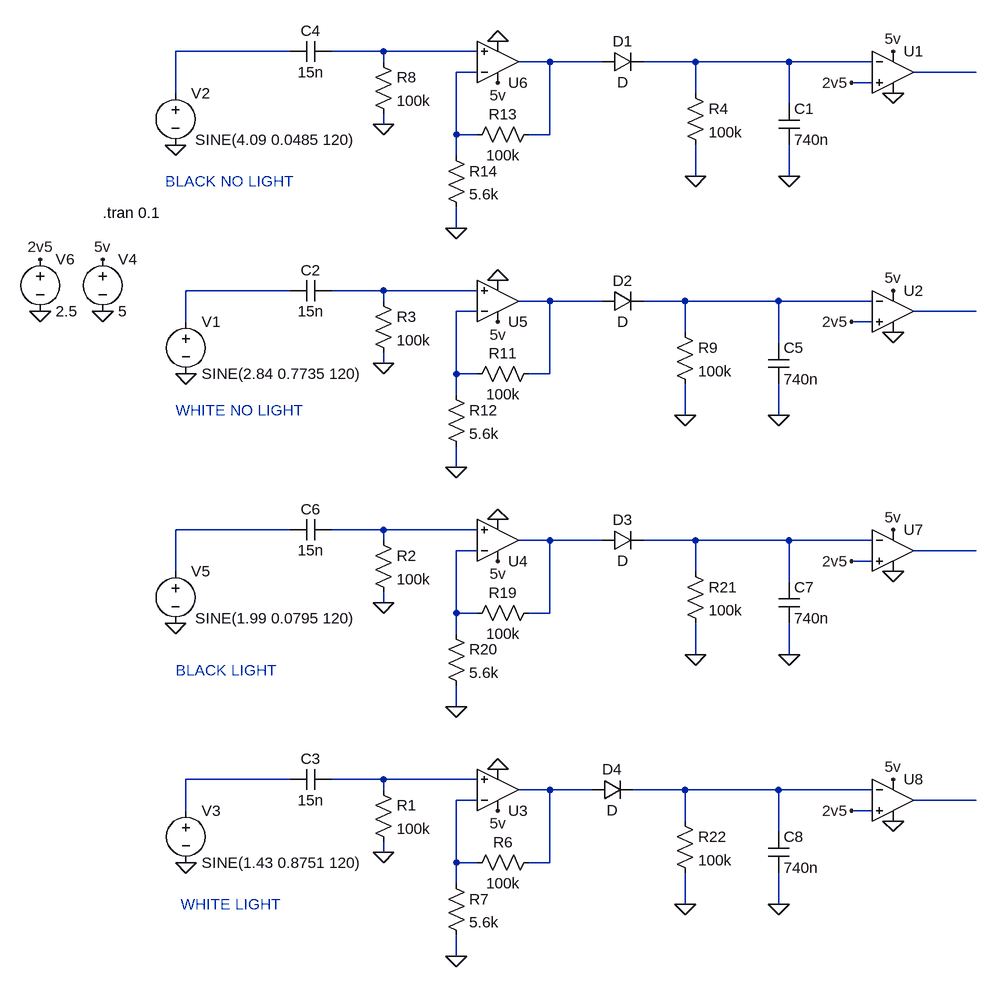
[diagram p0: schematic draft1.asc]
draft1.asc, the LTspice schematic file:
Version 4
SHEET 1 1572 1268
WIRE -64 -464 -240 -464
WIRE 80 -464 0 -464
WIRE 224 -464 80 -464
WIRE 80 -448 80 -464
WIRE 336 -448 288 -448
WIRE 416 -448 336 -448
WIRE 560 -448 480 -448
WIRE 704 -448 560 -448
WIRE 832 -448 704 -448
WIRE 224 -432 192 -432
WIRE 992 -432 896 -432
WIRE 832 -416 800 -416
WIRE -240 -400 -240 -464
WIRE 560 -400 560 -448
WIRE 704 -384 704 -448
WIRE 80 -352 80 -368
WIRE 192 -336 192 -432
WIRE 224 -336 192 -336
WIRE 336 -336 336 -448
WIRE 336 -336 304 -336
WIRE 192 -304 192 -336
WIRE 560 -272 560 -320
WIRE 704 -272 704 -320
WIRE 192 -192 192 -224
WIRE -64 -96 -224 -96
WIRE 80 -96 0 -96
WIRE 224 -96 80 -96
WIRE 80 -80 80 -96
WIRE 336 -80 288 -80
WIRE 416 -80 336 -80
WIRE 544 -80 480 -80
WIRE 688 -80 544 -80
WIRE 832 -80 688 -80
WIRE 224 -64 192 -64
WIRE 992 -64 896 -64
WIRE -224 -48 -224 -96
WIRE 832 -48 800 -48
WIRE 544 -32 544 -80
WIRE 688 -16 688 -80
WIRE 80 16 80 0
WIRE 192 32 192 -64
WIRE 224 32 192 32
WIRE 336 32 336 -80
WIRE 336 32 304 32
WIRE 192 64 192 32
WIRE 544 96 544 48
WIRE 688 96 688 48
WIRE 192 176 192 144
WIRE -64 272 -240 272
WIRE 80 272 0 272
WIRE 224 272 80 272
WIRE 80 288 80 272
WIRE 336 288 288 288
WIRE 416 288 336 288
WIRE 560 288 480 288
WIRE 704 288 560 288
WIRE 832 288 704 288
WIRE 224 304 192 304
WIRE 992 304 896 304
WIRE 832 320 800 320
WIRE -240 336 -240 272
WIRE 560 336 560 288
WIRE 704 352 704 288
WIRE 80 384 80 368
WIRE 192 400 192 304
WIRE 224 400 192 400
WIRE 336 400 336 288
WIRE 336 400 304 400
WIRE 192 432 192 400
WIRE 560 464 560 416
WIRE 704 464 704 416
WIRE 192 544 192 512
WIRE -64 656 -224 656
WIRE 80 656 0 656
WIRE 224 656 80 656
WIRE 80 672 80 656
WIRE 336 672 288 672
WIRE 400 672 336 672
WIRE 544 672 464 672
WIRE 688 672 544 672
WIRE 832 672 688 672
WIRE 224 688 192 688
WIRE 992 688 896 688
WIRE -224 704 -224 656
WIRE 832 704 800 704
WIRE 544 720 544 672
WIRE 688 736 688 672
WIRE 80 768 80 752
WIRE 192 784 192 688
WIRE 224 784 192 784
WIRE 336 784 336 672
WIRE 336 784 304 784
WIRE 192 816 192 784
WIRE 544 848 544 800
WIRE 688 848 688 800
WIRE 192 928 192 896
FLAG -224 32 0
FLAG -352 -64 0
FLAG -352 -144 5v
FLAG 80 16 0
FLAG -240 -320 0
FLAG 80 -352 0
FLAG 256 -48 5v
FLAG 256 -112 0
FLAG 192 176 0
FLAG 256 -416 5v
FLAG 256 -480 0
FLAG 192 -192 0
FLAG 560 -272 0
FLAG 704 -272 0
FLAG 544 96 0
FLAG 688 96 0
FLAG 864 -464 5v
FLAG 864 -400 0
FLAG 864 -96 5v
FLAG 864 -32 0
FLAG -224 784 0
FLAG 80 768 0
FLAG -240 416 0
FLAG 80 384 0
FLAG 256 704 5v
FLAG 256 640 0
FLAG 192 928 0
FLAG 256 320 5v
FLAG 256 256 0
FLAG 192 544 0
FLAG 560 464 0
FLAG 704 464 0
FLAG 544 848 0
FLAG 688 848 0
FLAG 864 272 5v
FLAG 864 336 0
FLAG 864 656 5v
FLAG 864 720 0
FLAG -448 -144 2v5
FLAG 800 -416 2v5
FLAG 800 -48 2v5
FLAG 800 320 2v5
FLAG 800 704 2v5
FLAG -448 -64 0
SYMBOL voltage -224 -64 R0
WINDOW 123 0 0 Left 2
WINDOW 39 0 0 Left 2
SYMATTR InstName V1
SYMATTR Value SINE(2.84 0.7735 120)
SYMBOL voltage -352 -160 R0
WINDOW 123 0 0 Left 2
WINDOW 39 0 0 Left 2
SYMATTR InstName V4
SYMATTR Value 5
SYMBOL cap 0 -112 R90
WINDOW 0 0 32 VBottom 2
WINDOW 3 32 32 VTop 2
SYMATTR InstName C2
SYMATTR Value 15n
SYMBOL res 64 -96 R0
SYMATTR InstName R3
SYMATTR Value 100k
SYMBOL voltage -240 -416 R0
WINDOW 123 0 0 Left 2
WINDOW 39 0 0 Left 2
WINDOW 3 30 88 Left 2
SYMATTR Value SINE(4.09 0.0485 120)
SYMATTR InstName V2
SYMBOL cap 0 -480 R90
WINDOW 0 0 32 VBottom 2
WINDOW 3 32 32 VTop 2
SYMATTR InstName C4
SYMATTR Value 15n
SYMBOL res 64 -464 R0
SYMATTR InstName R8
SYMATTR Value 100k
SYMBOL Opamps\\UniversalOpamp2 256 -80 M180
SYMATTR InstName U5
SYMBOL res 320 16 R90
WINDOW 0 0 56 VBottom 2
WINDOW 3 32 56 VTop 2
SYMATTR InstName R11
SYMATTR Value 100k
SYMBOL res 176 48 R0
SYMATTR InstName R12
SYMATTR Value 5.6k
SYMBOL Opamps\\UniversalOpamp2 256 -448 M180
SYMATTR InstName U6
SYMBOL res 320 -352 R90
WINDOW 0 0 56 VBottom 2
WINDOW 3 32 56 VTop 2
SYMATTR InstName R13
SYMATTR Value 100k
SYMBOL res 176 -320 R0
SYMATTR InstName R14
SYMATTR Value 5.6k
SYMBOL Opamps\\UniversalOpamp2 864 -432 R0
SYMATTR InstName U1
SYMBOL Opamps\\UniversalOpamp2 864 -64 R0
SYMATTR InstName U2
SYMBOL voltage -224 688 R0
WINDOW 123 0 0 Left 2
WINDOW 39 0 0 Left 2
SYMATTR InstName V3
SYMATTR Value SINE(1.43 0.8751 120)
SYMBOL cap 0 640 R90
WINDOW 0 0 32 VBottom 2
WINDOW 3 32 32 VTop 2
SYMATTR InstName C3
SYMATTR Value 15n
SYMBOL res 64 656 R0
SYMATTR InstName R1
SYMATTR Value 100k
SYMBOL voltage -240 320 R0
WINDOW 123 0 0 Left 2
WINDOW 39 0 0 Left 2
WINDOW 3 30 88 Left 2
SYMATTR Value SINE(1.99 0.0795 120)
SYMATTR InstName V5
SYMBOL cap 0 256 R90
WINDOW 0 0 32 VBottom 2
WINDOW 3 32 32 VTop 2
SYMATTR InstName C6
SYMATTR Value 15n
SYMBOL res 64 272 R0
SYMATTR InstName R2
SYMATTR Value 100k
SYMBOL Opamps\\UniversalOpamp2 256 672 M180
SYMATTR InstName U3
SYMBOL res 320 768 R90
WINDOW 0 0 56 VBottom 2
WINDOW 3 32 56 VTop 2
SYMATTR InstName R6
SYMATTR Value 100k
SYMBOL res 176 800 R0
SYMATTR InstName R7
SYMATTR Value 5.6k
SYMBOL Opamps\\UniversalOpamp2 256 288 M180
SYMATTR InstName U4
SYMBOL res 320 384 R90
WINDOW 0 0 56 VBottom 2
WINDOW 3 32 56 VTop 2
SYMATTR InstName R19
SYMATTR Value 100k
SYMBOL res 176 416 R0
SYMATTR InstName R20
SYMATTR Value 5.6k
SYMBOL Opamps\\UniversalOpamp2 864 304 R0
SYMATTR InstName U7
SYMBOL Opamps\\UniversalOpamp2 864 688 R0
SYMATTR InstName U8
SYMBOL cap 688 -384 R0
SYMATTR InstName C1
SYMATTR Value 740n
SYMBOL cap 672 -16 R0
SYMATTR InstName C5
SYMATTR Value 740n
SYMBOL cap 688 352 R0
SYMATTR InstName C7
SYMATTR Value 740n
SYMBOL cap 672 736 R0
SYMATTR InstName C8
SYMATTR Value 740n
SYMBOL res 544 -416 R0
SYMATTR InstName R4
SYMATTR Value 100k
SYMBOL res 528 -48 R0
SYMATTR InstName R9
SYMATTR Value 100k
SYMBOL res 544 320 R0
SYMATTR InstName R21
SYMATTR Value 100k
SYMBOL res 528 704 R0
SYMATTR InstName R22
SYMATTR Value 100k
SYMBOL diode 416 -432 R270
WINDOW 0 32 32 VTop 2
WINDOW 3 0 32 VBottom 2
SYMATTR InstName D1
SYMBOL diode 416 -64 R270
WINDOW 0 32 32 VTop 2
WINDOW 3 0 32 VBottom 2
SYMATTR InstName D2
SYMBOL diode 416 304 R270
WINDOW 0 32 32 VTop 2
WINDOW 3 0 32 VBottom 2
SYMATTR InstName D3
SYMBOL diode 400 688 R270
WINDOW 0 32 32 VTop 2
WINDOW 3 0 32 VBottom 2
SYMATTR InstName D4
SYMBOL voltage -448 -160 R0
WINDOW 123 0 0 Left 2
WINDOW 39 0 0 Left 2
SYMATTR InstName V6
SYMATTR Value 2.5
TEXT -352 -216 Left 2 !.tran 0.1
TEXT -256 -264 Left 2 ;BLACK NO LIGHT
TEXT -240 488 Left 2 ;BLACK LIGHT
TEXT -240 88 Left 2 ;WHITE NO LIGHT
TEXT -232 848 Left 2 ;WHITE LIGHT

The netlist it stands for:
* draft1.asc
V1 N007 0 SINE(2.84 0.7735 120)
V4 5v 0 5
C2 N008 N007 15n
R3 N008 0 100k
V2 N001 0 SINE(4.09 0.0485 120)
C4 N002 N001 15n
R8 N002 0 100k
XU5 N008 N011 5v 0 N009 level.2 Avol=1Meg GBW=10Meg Slew=10Meg ilimit=25m rail=0 Vos=0 phimargin=45 en=0 enk=0 in=0 ink=0 Rin=500Meg  ; pins IN+ IN- V+ V- OUT
R11 N009 N011 100k
R12 N011 0 5.6k
XU6 N002 N005 5v 0 N003 level.2 Avol=1Meg GBW=10Meg Slew=10Meg ilimit=25m rail=0 Vos=0 phimargin=45 en=0 enk=0 in=0 ink=0 Rin=500Meg  ; pins IN+ IN- V+ V- OUT
R13 N003 N005 100k
R14 N005 0 5.6k
XU1 2v5 N004 5v 0 N006 level.2 Avol=1Meg GBW=10Meg Slew=10Meg ilimit=25m rail=0 Vos=0 phimargin=45 en=0 enk=0 in=0 ink=0 Rin=500Meg  ; pins IN+ IN- V+ V- OUT
XU2 2v5 N010 5v 0 N012 level.2 Avol=1Meg GBW=10Meg Slew=10Meg ilimit=25m rail=0 Vos=0 phimargin=45 en=0 enk=0 in=0 ink=0 Rin=500Meg  ; pins IN+ IN- V+ V- OUT
V3 N019 0 SINE(1.43 0.8751 120)
C3 N020 N019 15n
R1 N020 0 100k
V5 N013 0 SINE(1.99 0.0795 120)
C6 N014 N013 15n
R2 N014 0 100k
XU3 N020 N023 5v 0 N021 level.2 Avol=1Meg GBW=10Meg Slew=10Meg ilimit=25m rail=0 Vos=0 phimargin=45 en=0 enk=0 in=0 ink=0 Rin=500Meg  ; pins IN+ IN- V+ V- OUT
R6 N021 N023 100k
R7 N023 0 5.6k
XU4 N014 N017 5v 0 N015 level.2 Avol=1Meg GBW=10Meg Slew=10Meg ilimit=25m rail=0 Vos=0 phimargin=45 en=0 enk=0 in=0 ink=0 Rin=500Meg  ; pins IN+ IN- V+ V- OUT
R19 N015 N017 100k
R20 N017 0 5.6k
XU7 2v5 N016 5v 0 N018 level.2 Avol=1Meg GBW=10Meg Slew=10Meg ilimit=25m rail=0 Vos=0 phimargin=45 en=0 enk=0 in=0 ink=0 Rin=500Meg  ; pins IN+ IN- V+ V- OUT
XU8 2v5 N022 5v 0 N024 level.2 Avol=1Meg GBW=10Meg Slew=10Meg ilimit=25m rail=0 Vos=0 phimargin=45 en=0 enk=0 in=0 ink=0 Rin=500Meg  ; pins IN+ IN- V+ V- OUT
C1 N004 0 740n
C5 N010 0 740n
C7 N016 0 740n
C8 N022 0 740n
R4 N004 0 100k
R9 N010 0 100k
R21 N016 0 100k
R22 N022 0 100k
D1 N003 N004 D
D2 N009 N010 D
D3 N015 N016 D
D4 N021 N022 D
V6 2v5 0 2.5
.model D D
.lib standard.dio
.tran 0.1
* BLACK NO LIGHT
* BLACK LIGHT
* WHITE NO LIGHT
* WHITE LIGHT
.lib UniversalOpamps2.sub
.backanno
.end